# Altium schematic sheet as14120_x31_usb.SchDoc
size A3; PageSetup: Record=PageOptions|CenterHorizontal=True|CenterVertical=True|PrintScale=1.02|XCorrection=1.00|YCorrection=1.00|PrintKind=0|BorderSize=5000000|LeftOffset=0|BottomOffset=0|Orientation=2|PaperLength=4200|PaperWidth=2970|Scale=100|PaperSource=7|PrintQuality=-4|MediaType=1|DitherType=10|PaperKind=A3 (бумага продольной резки) (297 x 420 мм)|PrintScaleMode=1
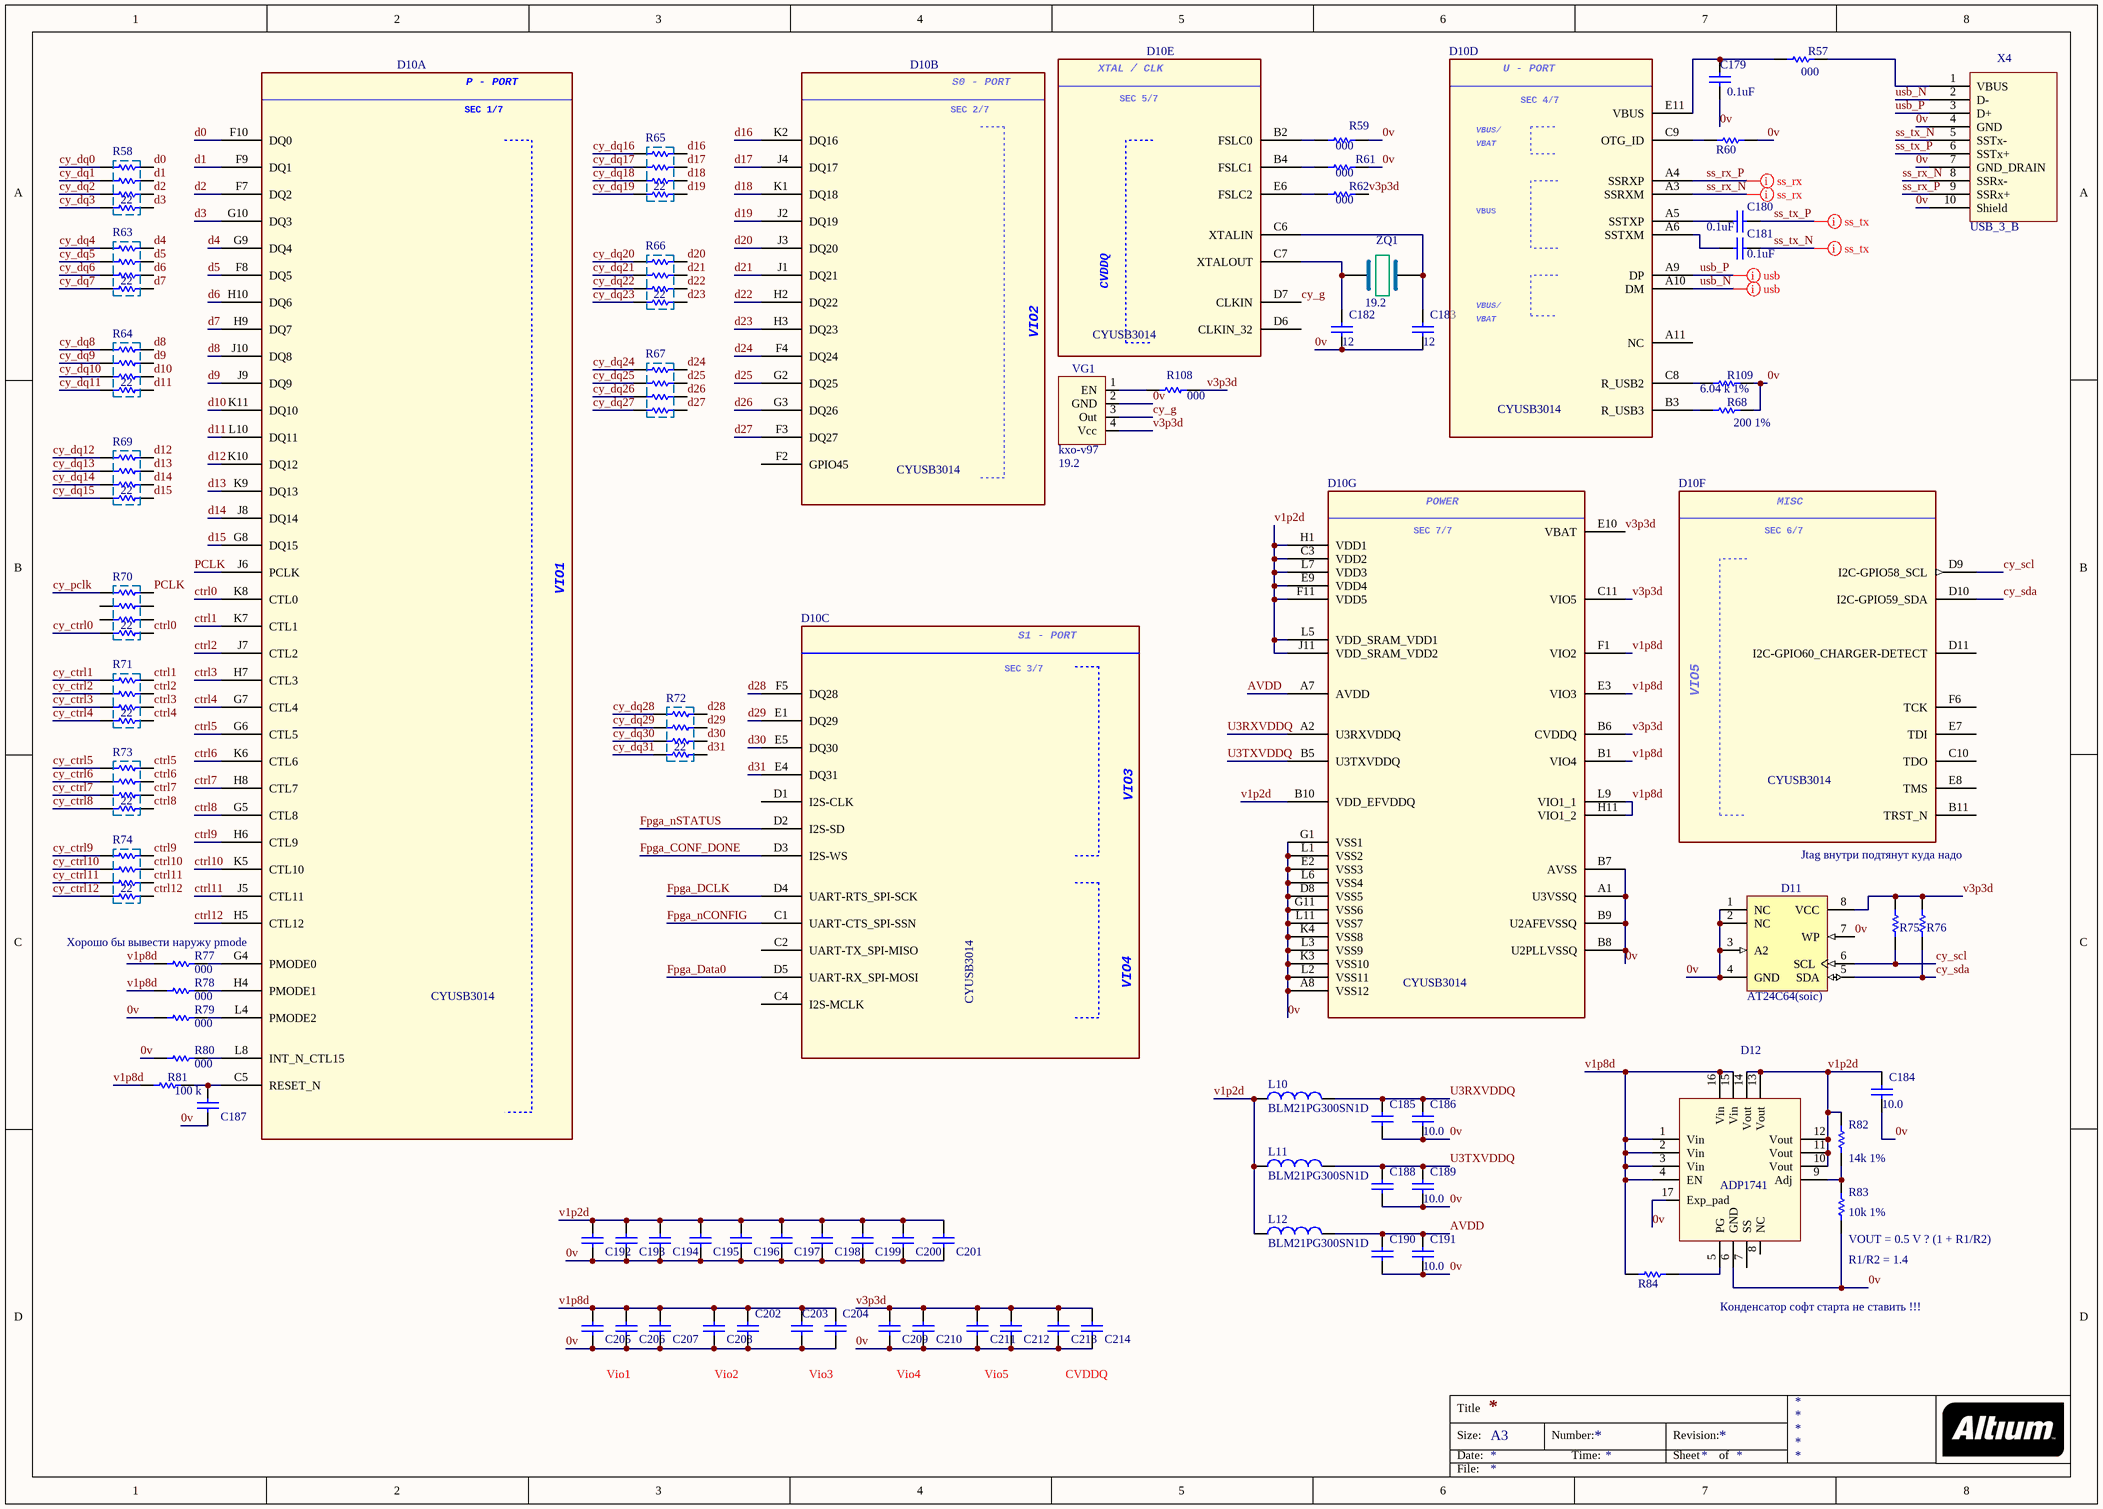
[diagram p0: as14120_x31_usb.SchDoc]

## Parts
C179  value 0.1uF  [CAPC0402(1005)60_M]  (hidden comment: CAP 1uF 10V 0402(1005))
C180  value 0.1uF  [CAPC0402(1005)60_M]  (hidden comment: CAP 1uF 10V 0402(1005))
C181  value 0.1uF  [CAPC0402(1005)60_M]  (hidden comment: CAP 1uF 10V 0402(1005))
C182  value 12  [CAPC0805(2012)100_N]  (hidden comment: CAP_0805)
C183  value 12  [CAPC0805(2012)100_N]  (hidden comment: CAP_0805)
C184  value 10.0  [CAPC0805(2012)100_N]  (hidden comment: CAP_0805)
C185  CAP 1uF 10V 0402(1005)  [CAPC0402(1005)60_M]  (value not drawn)
C186  value 10.0  [CAPC0805(2012)100_N]  (hidden comment: CAP_0805)
C187  CAP 1uF 10V 0402(1005)  [CAPC0402(1005)60_M]  (value not drawn)
C188  CAP 1uF 10V 0402(1005)  [CAPC0402(1005)60_M]  (value not drawn)
C189  value 10.0  [CAPC0805(2012)100_N]  (hidden comment: CAP_0805)
C190  CAP 1uF 10V 0402(1005)  [CAPC0402(1005)60_M]  (value not drawn)
C191  value 10.0  [CAPC0805(2012)100_N]  (hidden comment: CAP_0805)
C192  CAP 1uF 10V 0402(1005)  [CAPC0402(1005)60_M]  (value not drawn)
C193  CAP 1uF 10V 0402(1005)  [CAPC0402(1005)60_M]  (value not drawn)
C194  CAP 1uF 10V 0402(1005)  [CAPC0402(1005)60_M]  (value not drawn)
C195  CAP 1uF 10V 0402(1005)  [CAPC0402(1005)60_M]  (value not drawn)
C196  CAP 1uF 10V 0402(1005)  [CAPC0402(1005)60_M]  (value not drawn)
C197  CAP 1uF 10V 0402(1005)  [CAPC0402(1005)60_M]  (value not drawn)
C198  CAP 1uF 10V 0402(1005)  [CAPC0402(1005)60_M]  (value not drawn)
C199  CAP 1uF 10V 0402(1005)  [CAPC0402(1005)60_M]  (value not drawn)
C200  CAP 1uF 10V 0402(1005)  [CAPC0402(1005)60_M]  (value not drawn)
C201  CAP 1uF 10V 0402(1005)  [CAPC0402(1005)60_M]  (value not drawn)
C202  CAP 1uF 10V 0402(1005)  [CAPC0402(1005)60_M]  (value not drawn)
C203  CAP 1uF 10V 0402(1005)  [CAPC0402(1005)60_M]  (value not drawn)
C204  CAP 1uF 10V 0402(1005)  [CAPC0402(1005)60_M]  (value not drawn)
C205  CAP 1uF 10V 0402(1005)  [CAPC0402(1005)60_M]  (value not drawn)
C206  CAP 1uF 10V 0402(1005)  [CAPC0402(1005)60_M]  (value not drawn)
C207  CAP 1uF 10V 0402(1005)  [CAPC0402(1005)60_M]  (value not drawn)
C208  CAP 1uF 10V 0402(1005)  [CAPC0402(1005)60_M]  (value not drawn)
C209  CAP 1uF 10V 0402(1005)  [CAPC0402(1005)60_M]  (value not drawn)
C210  CAP 1uF 10V 0402(1005)  [CAPC0402(1005)60_M]  (value not drawn)
C211  CAP 1uF 10V 0402(1005)  [CAPC0402(1005)60_M]  (value not drawn)
C212  CAP 1uF 10V 0402(1005)  [CAPC0402(1005)60_M]  (value not drawn)
C213  CAP 1uF 10V 0402(1005)  [CAPC0402(1005)60_M]  (value not drawn)
C214  CAP 1uF 10V 0402(1005)  [CAPC0402(1005)60_M]  (value not drawn)
D10  CYUSB3014  [BGA121C80P11X11]  (parts A,B,C,D,E,F,G of 7)
D11  AT24C64(soic)  [8S1_N]
D12  ADP1741  [CP-16-4_N]
L10  BLM21PG300SN1D  [CAPC0805(2012)100_N]
L11  BLM21PG300SN1D  [CAPC0805(2012)100_N]
L12  BLM21PG300SN1D  [CAPC0805(2012)100_N]
R57  value 000  [RESC0805(2012)_L]  (hidden comment: 1K 1% 0805(2012))
R58  22  [CAY16]
R59  value 000  [RESC0603(1608)_L]  (hidden comment: 1K 5% 0603(1608))
R60  ???  [RESC0603(1608)_L]  (value not drawn)
R61  value 000  [RESC0603(1608)_L]  (hidden comment: 1K 5% 0603(1608))
R62  value 000  [RESC0603(1608)_L]  (hidden comment: 1K 5% 0603(1608))
R63  22  [CAY16]
R64  22  [CAY16]
R65  22  [CAY16]
R66  22  [CAY16]
R67  (no value)  [CAY16]
R68  value 200 1%  [RESC0805(2012)_L]  (hidden comment: 1K 1% 0805(2012))
R69  22  [CAY16]
R70  22  [CAY16]
R71  22  [CAY16]
R72  22  [CAY16]
R73  22  [CAY16]
R74  22  [CAY16]
R75  1K 5% 0603(1608)  [RESC0603(1608)_L]  (value not drawn)
R76  1K 5% 0603(1608)  [RESC0603(1608)_L]  (value not drawn)
R77  value 000  [RESC0603(1608)_L]  (hidden comment: 1K 5% 0603(1608))
R78  value 000  [RESC0603(1608)_L]  (hidden comment: 1K 5% 0603(1608))
R79  value 000  [RESC0603(1608)_L]  (hidden comment: 1K 5% 0603(1608))
R80  value 000  [RESC0603(1608)_L]  (hidden comment: 1K 5% 0603(1608))
R81  value 100 k  [RESC0603(1608)_L]  (hidden comment: 1K 5% 0603(1608))
R82  value 14k 1%  [RESC0805(2012)_L]  (hidden comment: 1K 1% 0805(2012))
R83  value 10k 1%  [RESC0805(2012)_L]  (hidden comment: 1K 1% 0805(2012))
R84  1K 5% 0603(1608)  [RESC0603(1608)_L]  (value not drawn)
R108  value 000  [RESC0603(1608)_L]  (hidden comment: 1K 5% 0603(1608))
R109  value 6.04 k 1%  [RESC0805(2012)_L]  (hidden comment: 1K 1% 0805(2012))
VG1  kxo-v97  value 19.2  [kxo-v97]
X4  USB_3_B  [USB3_B]
ZQ1  value 19.2  [BCY-W2/E4.7]  (hidden comment: Resonator)

## Nets
0v: C179.2 C182.1 C183.1 C184.1 C185.1 C186.1 C187.1 C188.1 C189.1 C190.1 C191.1 C192.1 C193.1 C194.1 C195.1 C196.1 C197.1 C198.1 C199.1 C200.1 C201.1 C202.1 C203.1 C204.1 C205.1 C206.1 C207.1 C208.1 C209.1 C210.1 C211.1 C212.1 C213.1 C214.1 D10.A1(U3VSSQ) D10.A8(VSS12) D10.B7(AVSS) D10.B8(U2PLLVSSQ) D10.B9(U2AFEVSSQ) D10.D8(VSS5) D10.E2(VSS3) D10.G1(VSS1) D10.G11(VSS6) D10.K3(VSS10) D10.K4(VSS8) D10.L1(VSS2) D10.L2(VSS11) D10.L3(VSS9) D10.L6(VSS4) D10.L11(VSS7) D11.1(NC) D11.2(NC) D11.3(A2) D11.4(GND) D11.7(WP) D12.6(GND) D12.17(Exp_pad) R59.1 R60.2 R61.1 R68.2 R79.2 R80.2 R83.1 R109.2 VG1.2(GND) X4.4(GND) X4.7(GND_DRAIN) X4.10(Shield)
AVDD: C190.2 C191.2 D10.A7(AVDD) L12.2
ctrl0: D10.K8(CTL0) R70.5
ctrl1: D10.K7(CTL1) R71.8
ctrl2: D10.J7(CTL2) R71.7
ctrl3: D10.H7(CTL3) R71.6
ctrl4: D10.G7(CTL4) R71.5
ctrl5: D10.G6(CTL5) R73.8
ctrl6: D10.K6(CTL6) R73.7
ctrl7: D10.H8(CTL7) R73.6
ctrl8: D10.G5(CTL8) R73.5
ctrl9: D10.H6(CTL9) R74.8
ctrl10: D10.K5(CTL10) R74.7
ctrl11: D10.J5(CTL11) R74.6
ctrl12: D10.H5(CTL12) R74.5
cy_ctrl0: R70.4
cy_ctrl1: R71.1
cy_ctrl2: R71.2
cy_ctrl3: R71.3
cy_ctrl4: R71.4
cy_ctrl5: R73.1
cy_ctrl6: R73.2
cy_ctrl7: R73.3
cy_ctrl8: R73.4
cy_ctrl9: R74.1
cy_ctrl10: R74.2
cy_ctrl11: R74.3
cy_ctrl12: R74.4
cy_dq0: R58.1
cy_dq1: R58.2
cy_dq2: R58.3
cy_dq3: R58.4
cy_dq4: R63.1
cy_dq5: R63.2
cy_dq6: R63.3
cy_dq7: R63.4
cy_dq8: R64.1
cy_dq9: R64.2
cy_dq10: R64.3
cy_dq11: R64.4
cy_dq12: R69.1
cy_dq13: R69.2
cy_dq14: R69.3
cy_dq15: R69.4
cy_dq16: R65.1
cy_dq17: R65.2
cy_dq18: R65.3
cy_dq19: R65.4
cy_dq20: R66.1
cy_dq21: R66.2
cy_dq22: R66.3
cy_dq23: R66.4
cy_dq24: R67.1
cy_dq25: R67.2
cy_dq26: R67.3
cy_dq27: R67.4
cy_dq28: R72.1
cy_dq29: R72.2
cy_dq30: R72.3
cy_dq31: R72.4
cy_g: D10.D7(CLKIN) VG1.3(Out)
cy_pclk: R70.1
cy_scl: D10.D9(I2C-GPIO58_SCL) D11.6(SCL) R75.1
cy_sda: D10.D10(I2C-GPIO59_SDA) D11.5(SDA) R76.1
d0: D10.F10(DQ0) R58.8
d1: D10.F9(DQ1) R58.7
d2: D10.F7(DQ2) R58.6
d3: D10.G10(DQ3) R58.5
d4: D10.G9(DQ4) R63.8
d5: D10.F8(DQ5) R63.7
d6: D10.H10(DQ6) R63.6
d7: D10.H9(DQ7) R63.5
d8: D10.J10(DQ8) R64.8
d9: D10.J9(DQ9) R64.7
d10: D10.K11(DQ10) R64.6
d11: D10.L10(DQ11) R64.5
d12: D10.K10(DQ12) R69.8
d13: D10.K9(DQ13) R69.7
d14: D10.J8(DQ14) R69.6
d15: D10.G8(DQ15) R69.5
d16: D10.K2(DQ16) R65.8
d17: D10.J4(DQ17) R65.7
d18: D10.K1(DQ18) R65.6
d19: D10.J2(DQ19) R65.5
d20: D10.J3(DQ20) R66.8
d21: D10.J1(DQ21) R66.7
d22: D10.H2(DQ22) R66.6
d23: D10.H3(DQ23) R66.5
d24: D10.F4(DQ24) R67.8
d25: D10.G2(DQ25) R67.7
d26: D10.G3(DQ26) R67.6
d27: D10.F3(DQ27) R67.5
d28: D10.F5(DQ28) R72.8
d29: D10.E1(DQ29) R72.7
d30: D10.E5(DQ30) R72.6
d31: D10.E4(DQ31) R72.5
Fpga_CONF_DONE: D10.D3(I2S-WS)
Fpga_Data0: D10.D5(UART-RX_SPI-MOSI)
Fpga_DCLK: D10.D4(UART-RTS_SPI-SCK)
Fpga_nCONFIG: D10.C1(UART-CTS_SPI-SSN)
Fpga_nSTATUS: D10.D2(I2S-SD)
PCLK: D10.J6(PCLK) R70.8
ss_rx_N: D10.A3(SSRXM) X4.8(SSRx-)
ss_rx_P: D10.A4(SSRXP) X4.9(SSRx+)
ss_tx_N: C181.1 X4.5(SSTx-)
ss_tx_P: C180.1 X4.6(SSTx+)
U3RXVDDQ: C185.2 C186.2 D10.A2(U3RXVDDQ) L10.2
U3TXVDDQ: C188.2 C189.2 D10.B5(U3TXVDDQ) L11.2
usb_N: D10.A10(DM) X4.2(D-)
usb_P: D10.A9(DP) X4.3(D+)
v1p2d: C184.2 C192.2 C193.2 C194.2 C195.2 C196.2 C197.2 C198.2 C199.2 C200.2 C201.2 D10.B10(VDD_EFVDDQ) D10.C3(VDD2) D10.E9(VDD4) D10.F11(VDD5) D10.H1(VDD1) D10.J11(VDD_SRAM_VDD2) D10.L5(VDD_SRAM_VDD1) D10.L7(VDD3) D12.10(Vout) D12.11(Vout) D12.12(Vout) D12.13(Vout) D12.14(Vout) L10.1 L11.1 L12.1 R82.2
v1p8d: C202.2 C203.2 C204.2 C205.2 C206.2 C207.2 C208.2 D10.B1(VIO4) D10.E3(VIO3) D10.F1(VIO2) D10.H11(VIO1_2) D10.L9(VIO1_1) D12.1(Vin) D12.2(Vin) D12.3(Vin) D12.4(EN) D12.15(Vin) D12.16(Vin) R77.2 R78.2 R81.2 R84.2
v3p3d: C209.2 C210.2 C211.2 C212.2 C213.2 C214.2 D10.B6(CVDDQ) D10.C11(VIO5) D10.E10(VBAT) D11.8(VCC) R62.1 R75.2 R76.2 R108.1 VG1.4(Vcc)
NetC179_1: C179.1 D10.E11(VBUS) R57.1
NetC180_2: C180.2 D10.A5(SSTXP)
NetC181_2: C181.2 D10.A6(SSTXM)
NetC182_2: C182.2 D10.C7(XTALOUT) ZQ1.1
NetC183_2: C183.2 D10.C6(XTALIN) ZQ1.2
NetC187_2: C187.2 D10.C5(RESET_N) R81.1
NetD10_B2: D10.B2(FSLC0) R59.2
NetD10_B3: D10.B3(R_USB3) R68.1
NetD10_B4: D10.B4(FSLC1) R61.2
NetD10_C8: D10.C8(R_USB2) R109.1
NetD10_C9: D10.C9(OTG_ID) R60.1
NetD10_E6: D10.E6(FSLC2) R62.2
NetD10_G4: D10.G4(PMODE0) R77.1
NetD10_H4: D10.H4(PMODE1) R78.1
NetD10_L4: D10.L4(PMODE2) R79.1
NetD10_L8: D10.L8(INT_N_CTL15) R80.1
NetD12_5: D12.5(PG) R84.1
NetD12_9: D12.9(Adj) R82.1 R83.2
NetR57_2: R57.2 X4.1(VBUS)
NetR108_2: R108.2 VG1.1(EN)

Not connected (* = marked no-connect by the designer): D10 A11(NC) B11(TRST_N) C2(UART-TX_SPI-MISO) C4(I2S-MCLK) C10(TDO) D1(I2S-CLK) D6(CLKIN_32) D11(I2C-GPIO60_CHARGER-DETECT) E7(TDI) E8(TMS) F2(GPIO45) F6(TCK); D12 7(SS) 8(NC); R70 2 3 6 7

## Layout directives
differential pair: ss_rx_N, ss_rx_P, ss_tx_N, ss_tx_P, usb_N, usb_P

## Notes on the sheet
- Jtag внутри подтянут куда надо
- Хорошо бы вывести наружу pmode
- (near R83) VOUT = 0.5 V ? (1 + R1/R2)
- R1/R2 = 1.4
- Конденсатор софт старта не ставить !!!
- Vio1
- Vio2
- Vio3
- Vio4
- Vio5
- CVDDQ
- Title
- Size:
- Date:
- A3
- Number:
- Time:
- Revision:
- Sheet
- of
- File:
- (in symbol CYUSB3014-BZXC, part A) P - PORT; SEC 1/7; VIO1
- (in symbol CYUSB3014-BZXC, part B) S0 - PORT; SEC 2/7
- (in symbol CYUSB3014-BZXC, part C) S1 - PORT; SEC 3/7
- (in symbol CYUSB3014-BZXC, part D) U - PORT; SEC 4/7; VBUS/
- (in symbol CYUSB3014-BZXC, part E) XTAL / CLK; SEC 5/7
- (in symbol CYUSB3014-BZXC, part F) MISC; SEC 6/7
- (in symbol CYUSB3014-BZXC, part G) POWER; SEC 7/7

## Library data of the parts
C179-C181 C185 C187 C188 C190 C192-C214 = CAP_0402: CAP 1uF 10V ±20% 0402 (1005 Metric) Thickness 0.6mm SMD; Case-Metric: 1005; Case-EIA: 0402; Tolerance: ±20%; Max Thickness: 0.6 mm; Rated Voltage: 10 V; Technology: SMT
  C185 C187 C188 C190 C192-C214: Value: 1uF
D10 = CYUSB3014-BZXC
D11 = AT24C08BN-SP25-T: 8Kbit (1024 x 8), 2-wire Bus Automotive Serial EEPROM with Write Protect, 2.5V, 8-Pin SOIC, Tape & Reel; DatasheetVersion: 8517C,  Jan-2009; PackageVersion: revC, Mar-2005; PackageReference: 8S1; PackageDescription: 8-Lead (0.150" Wide Body), Plastic Gull Wing Small Outline (JEDEC SOIC); Code_JEDEC: MS-012-AA; Code_IPC: SOIC127P600-8; ComponentLink1Description: Manufacturer URL; ComponentLink1URL: http://www.atmel.com/; ComponentLink2Description: Datasheet; ComponentLink2URL: http://www.atmel.com/dyn/resources/prod_documents/doc8517.pdf
L10-L12 = Ferrite_beat
R57 R68 R82 R83 R109 = RES_0805: 1K 0.125W 1% 0805 (2012 Metric)  SMD; Case-Metric: 2012; Case-EIA: 0805; Tolerance: 1 %; Power: 0.125 W; Technology: SMT
R58 R63-R67 R69-R74 = cay16-J4
  R58 R63-R66 R69-R74: Value: 22
R59-R62 R77-R81 R108 = RES_0603: 1K 0.1W 5% 0603 (1608 Metric)  SMD; Case-EIA: 0603; Case-Metric: 1608; Technology: SMT; Tolerance: 5 %; Power: 0.1 W
  R60: Value: ???
R75 R76 = RES_0603: 1K 0.1W 5% 0603 (1608 Metric)  SMD; Case-EIA: 0603; Case-Metric: 1608; Value: 2.2 k; Technology: SMT; Tolerance: 5 %; Power: 0.1 W
R84 = RES_0603: 1K 0.1W 5% 0603 (1608 Metric)  SMD; Case-EIA: 0603; Case-Metric: 1608; Value: 100k; Technology: SMT; Tolerance: 5 %; Power: 0.1 W